# EAGLE design BP_devboard (EAGLE 9.7.0)
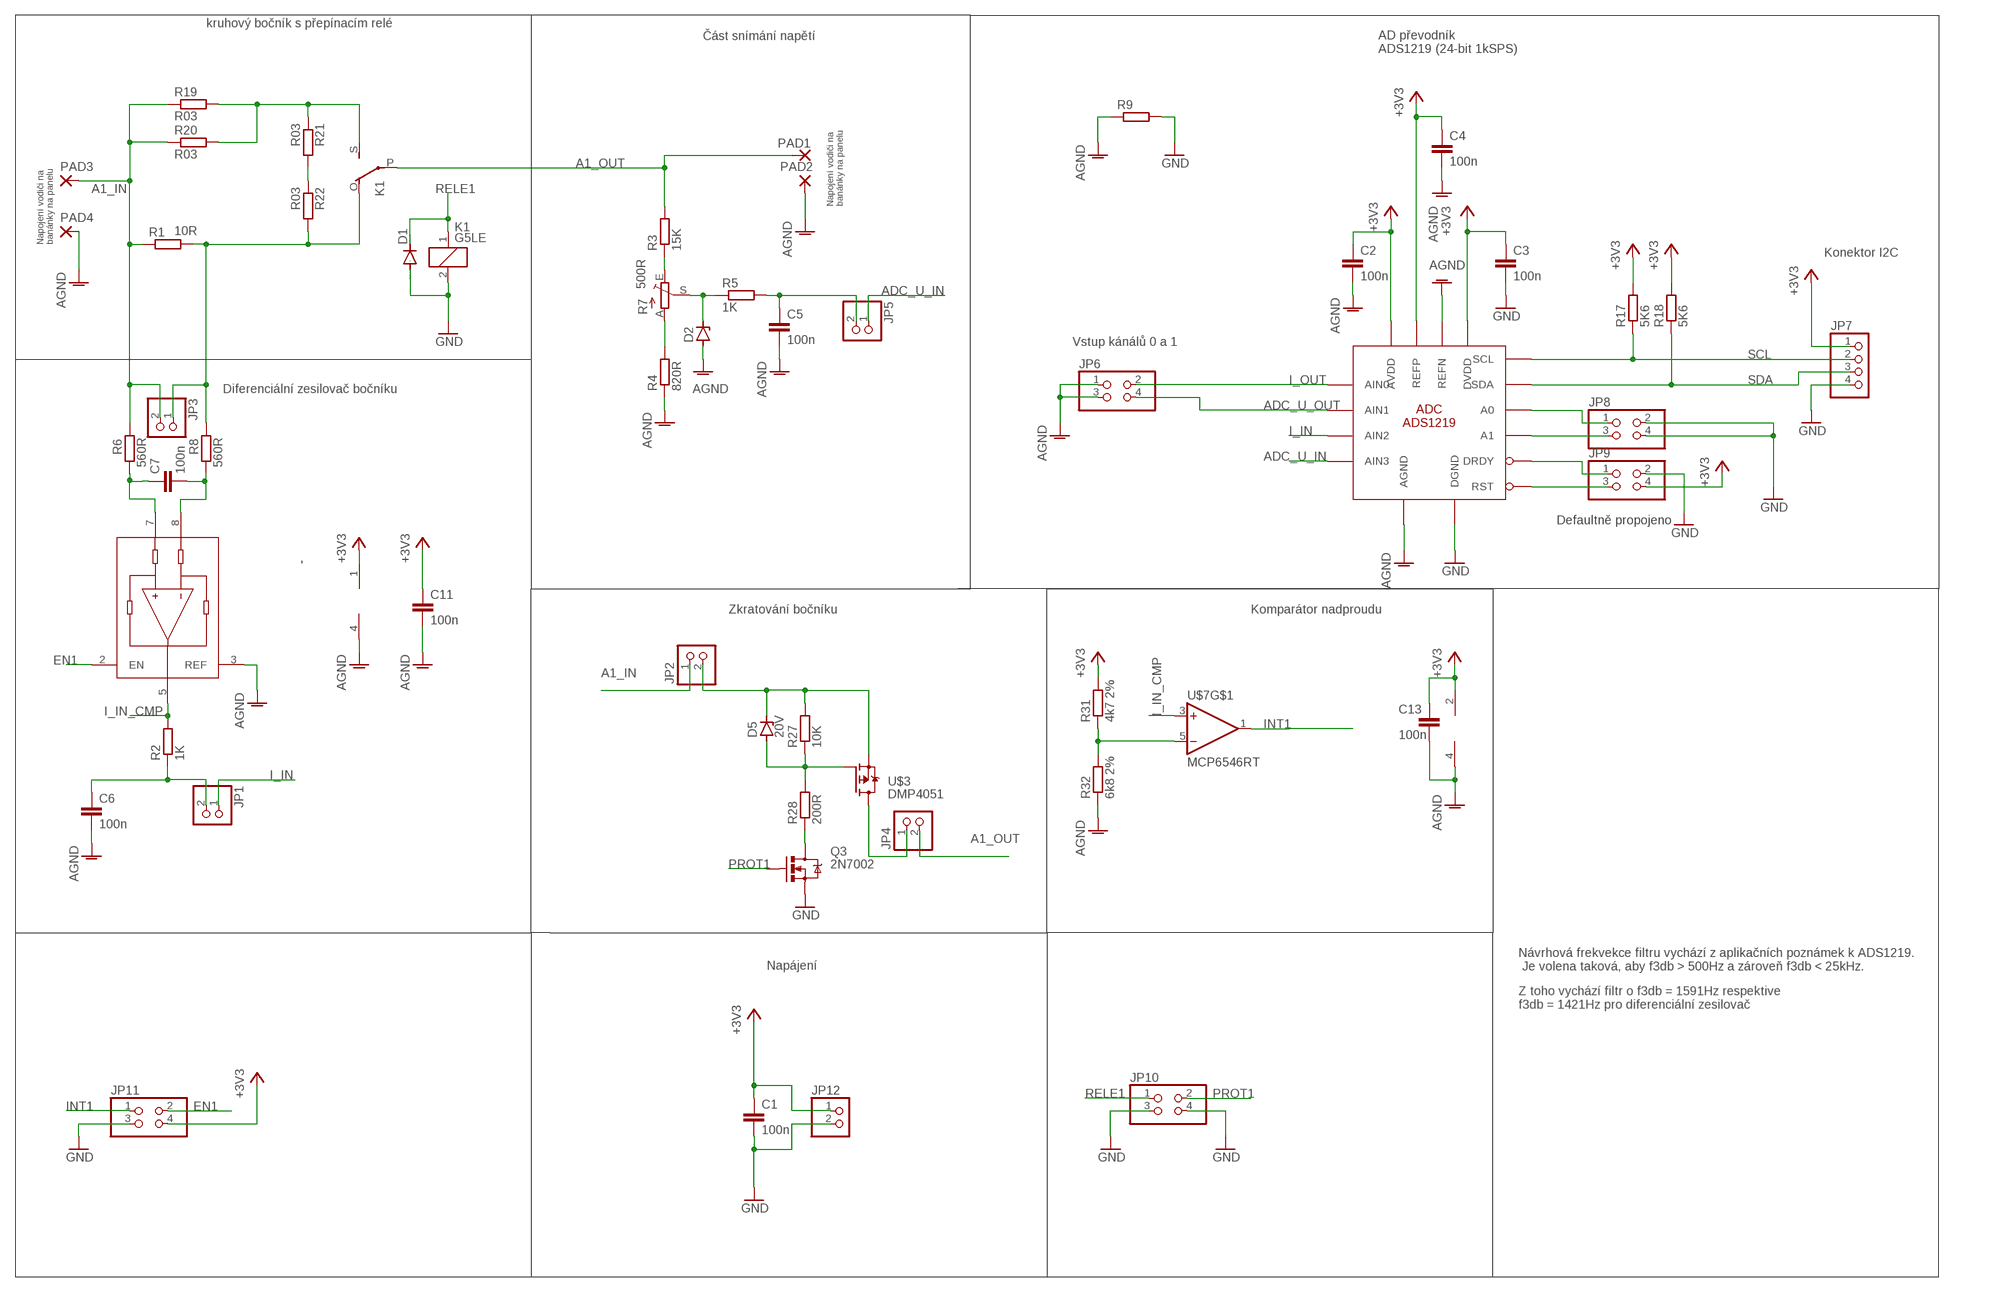
[diagram p0: schematic, sheet 1]

## Parts
C1  100n  C-EUC0805  [C0805]
C2  100n  C-EUC0805  [C0805]
C3  100n  C-EUC0805  [C0805]
C4  100n  C-EUC0805  [C0805]
C5  100n  C-EUC0805  [C0805]
C6  100n  C-EUC0805  [C0805]
C7  100n  C-EUC0805  [C0805]
C11  100n  C-EUC0805  [C0805]
C13  100n  C-EUC0805  [C0805]
D1  DIODE-MELF-MLL41  [MELF-MLL41]
D2  ZENER-DIODESOD80C  [SOD80C]
D5  20V  ZENER-DIODESMB  [SMB]
JP1  PINHD-1X2  [1X02]
JP2  PINHD-1X2  [1X02]
JP3  PINHD-1X2  [1X02]
JP4  PINHD-1X2  [1X02]
JP5  PINHD-1X2  [1X02]
JP6  PINHD-2X2  [2X02]
JP7  PINHD-1X4  [1X04]
JP8  PINHD-2X2  [2X02]
JP9  PINHD-2X2  [2X02]
JP10  PINHD-2X2  [2X02]
JP11  PINHD-2X2  [2X02]
JP12  PINHD-1X2  [1X02]
K1  G5LE  [G5LE]
PAD1  2,15/1,0  [2,15/1,0]
PAD2  2,15/1,0  [2,15/1,0]
PAD3  2,15/1,0  [2,15/1,0]
PAD4  2,15/1,0  [2,15/1,0]
Q3  2N7002  MOSFET-NCHANNEL2N7002PW  [SOT323]
R1  10R  R-EU_R1206  [R1206]
R2  1K  R-EU_R0805  [R0805]
R3  15K  R-EU_R0805  [R0805]
R4  820R  R-EU_R0805  [R0805]
R5  1K  R-EU_R0805  [R0805]
R6  560R  R-EU_R0805  [R0805]
R7  500R  TRIM_EU-PT10  [PT-10]
R8  560R  R-EU_R0805  [R0805]
R9  R-EU_R0805  [R0805]
R17  5K6  R-EU_R0805  [R0805]
R18  5K6  R-EU_R0805  [R0805]
R19  R03  R-EU_R1206  [R1206]
R20  R03  R-EU_R1206  [R1206]
R21  R03  R-EU_R1206  [R1206]
R22  R03  R-EU_R1206  [R1206]
R27  10K  R-EU_R0805  [R0805]
R28  200R  R-EU_R0805  [R0805]
R31  4k7 2%  R-EU_R0805  [R0805]
R32  6k8 2%  R-EU_R0805  [R0805]
U$2  ADS1219  [TSSOP16]
U$3  DMP4051  [TO252]
U$4  INA190  [SOT-23-THIN]
U$7  MCP6546RT  [SOT23-5]

## Nets
+3V3: C1.1 C2.1 C3.1 C4.1 C11.1 C13.1 JP7.1 JP9.4 JP11.4 JP12.1 R17.2 R18.2 R31.2 U$2.9(REFP) U$2.12(AVDD) U$2.13(DVDD) U$4.1(V+) U$7.2(V+)
A1: JP8.3 U$2.2(A1)
A1_IN: JP2.1 JP3.2 PAD3.1(P) R1.1 R6.2 R19.1 R20.1
A1_OUT: JP4.2 K1.P(2:P) PAD1.1(P) R3.2
ADC_U_IN: JP5.1 U$2.6(AIN3)
ADC_U_OUT: JP6.4 U$2.10(AIN1)
AGND: C2.2 C4.2 C5.2 C6.2 C11.2 C13.2 D2.A JP6.1 JP6.3 PAD2.1(P) PAD4.1(P) R4.1 R9.1 R32.1 U$2.5(AGND) U$2.8(REFN) U$4.3(REF) U$4.4(V-) U$7.4(V-)
EN1: JP11.2 U$4.2(EN)
GND: C1.2 C3.2 D1.A JP7.4 JP8.2 JP8.4 JP9.2 JP10.3 JP10.4 JP11.3 JP12.2 K1.2 Q3.2(S) R9.2 U$2.4(DGND)
I_IN: JP1.1 U$2.7(AIN2)
I_IN_CMP: R2.2 U$4.5 U$7.3(+IN)
I_OUT: JP6.2 U$2.11(AIN0)
INT1: JP11.1 U$7.1(OUT)
N$1: JP3.1 K1.O(2:O) R1.2 R8.2 R22.2
N$2: R3.1 R7.E
N$3: R4.2 R7.A
N$4: C6.1 JP1.2 R2.1
N$5: D2.C R5.1 R7.S
N$6: JP4.1 U$3.3(D)
N$7: C7.2 R8.1 U$4.8(-)
N$8: D5.C JP2.2 R27.2 U$3.2(S)
N$9: D5.A R27.1 R28.2 U$3.1(G)
N$10: C5.1 JP5.2 R5.2
N$11: Q3.3(D) R28.1
N$13: JP8.1 U$2.1(A0)
N$14: JP9.1 U$2.14(DRDY)
N$15: JP9.3 U$2.3(RST)
N$16: K1.S(2:S) R19.2 R20.2 R21.1
N$17: R31.1 R32.2 U$7.5(-IN)
N$18: C7.1 R6.1 U$4.7(+)
N$19: R21.2 R22.1
PROT1: JP10.2 Q3.1(G)
RELE1: D1.C JP10.1 K1.1
SCL: JP7.2 R17.1 U$2.16(SCL)
SDA: JP7.3 R18.1 U$2.15(SDA)

## Notes on the sheet
- kruhový bočník s přepínacím relé
- Část snímání napětí
- AD převodník
  ADS1219 (24-bit 1kSPS)
- Napojení vodiči na
  banánky na panelu
- Napojení vodiči na
  banánky na panelu
- Konektor I2C
- Vstup kánálů 0 a 1
- Diferenciální zesilovač bočníku
- Defaultně propojeno
- Zkratování bočníku | Komparátor nadproudu
- Návrhová frekvekce filtru vychází z aplikačních poznámek k ADS1219.
   Je volena taková, aby f3db > 500Hz a zároveň f3db < 25kHz.
- Napájení
- Z toho vychází filtr o f3db = 1591Hz respektive 
  f3db = 1421Hz pro diferenciální zesilovač

## Library data of the parts
C1-C7 C11 C13 = rcl:C-EU: CAPACITOR, European symbol; SPICEPREFIX: C
D1 = diode:DIODE-: DIODE
D2 D5 = diode:ZENER-DIODE: Z-Diode
JP1-JP5 JP12 = pinhead:PINHD-1X2: PIN HEADER
JP6 JP8-JP11 = pinhead:PINHD-2X2: PIN HEADER
JP7 = pinhead:PINHD-1X4: PIN HEADER
K1 = relay:G5LE: RELAY 1 x switch, 10 A/120 V AC, 8 A/30 V DC, Omron; OC_FARNELL: unknown; OC_NEWARK: unknown
PAD1-PAD4 = wirepad:2,15/1,0: THROUGH-HOLE PAD
Q3 = BeagleBone_Blue_R3:MOSFET-NCHANNEL: Common NMOSFET Parts MFG P/N Store ID Prod ID FDD8780 TRANS-09984 SI7820DN TRANS-11055 FDS6630A IC-08089 2N7002PW TRANS-11151 FQP30N06L COM-10213 TRANS-10060 BSS123LT1G TRANS-08345 BSS138 TRANS-00830 BS170 2N7000; PROD_ID: TRANS-11151
R1-R6 R8 R9 R17-R22 R27 R28 R31 R32 = rcl:R-EU_: RESISTOR, European symbol; SPICEPREFIX: R
R7 = pot:TRIM_EU-: POTENTIOMETER
U$2 = ADC_TI:ADS1219
U$3 = Mosfety:DMP4051
U$4 = merici_zesilovace:INA190
U$7 = merici_zesilovace:MCP6546RT

## Board
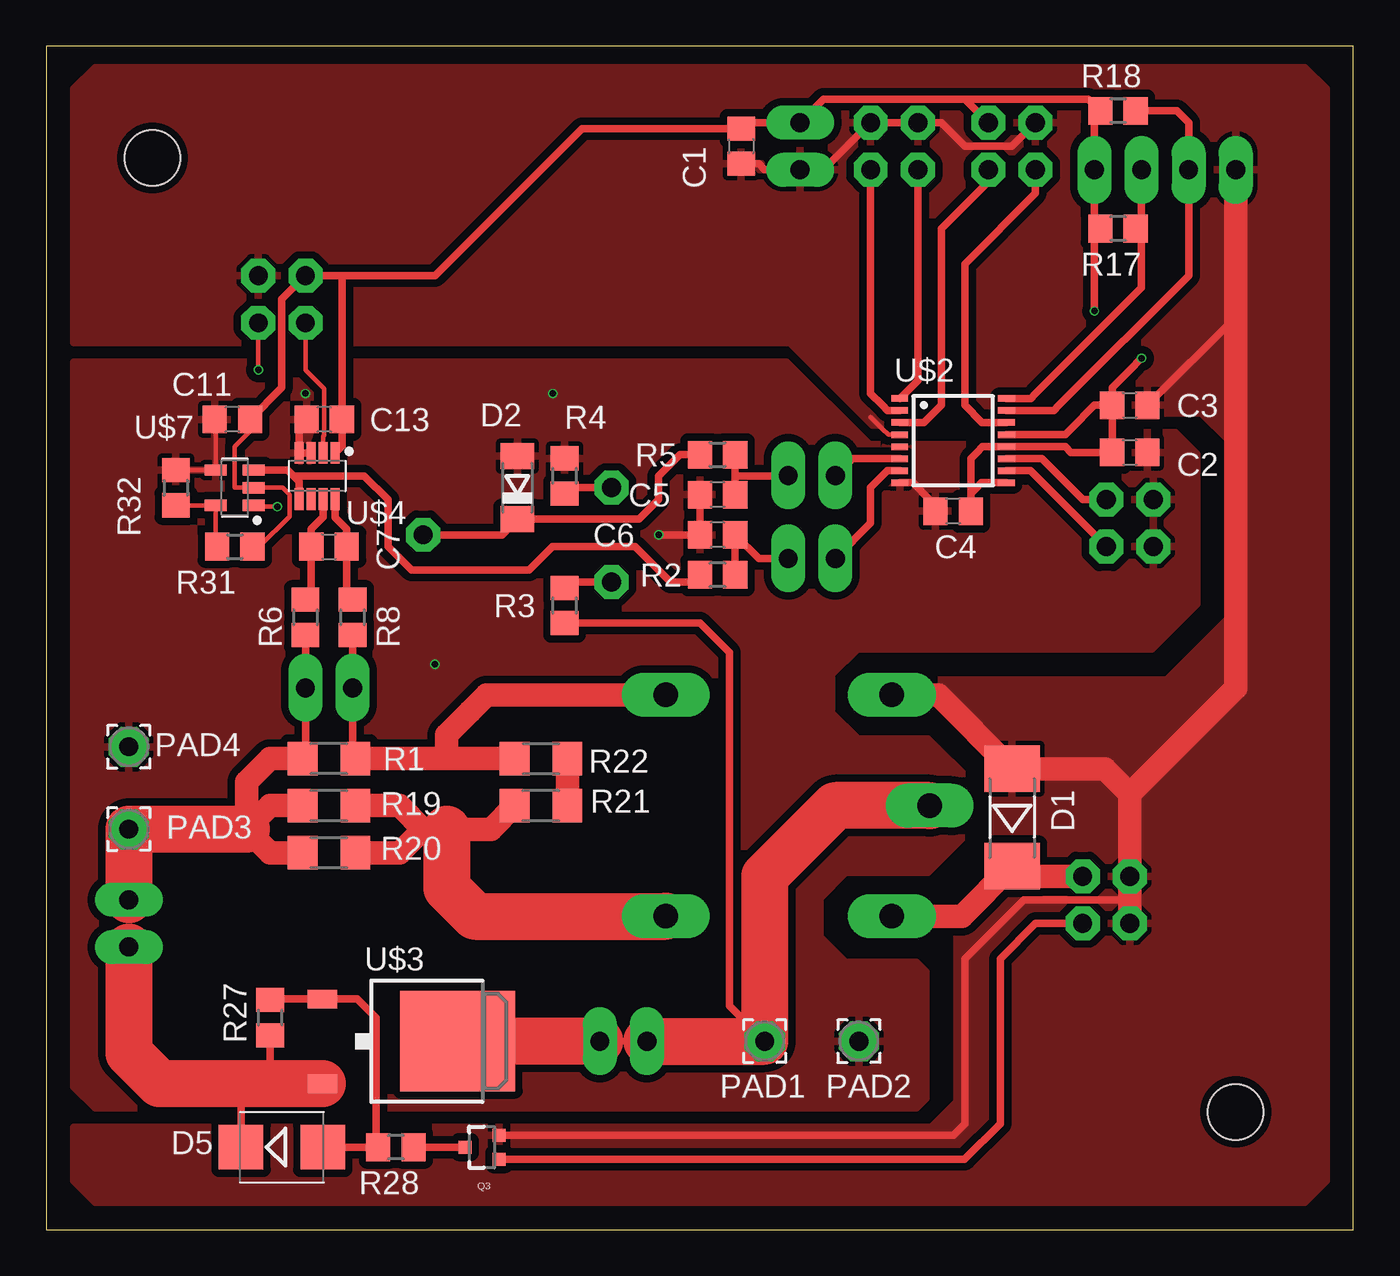
[diagram p1: board, top side]
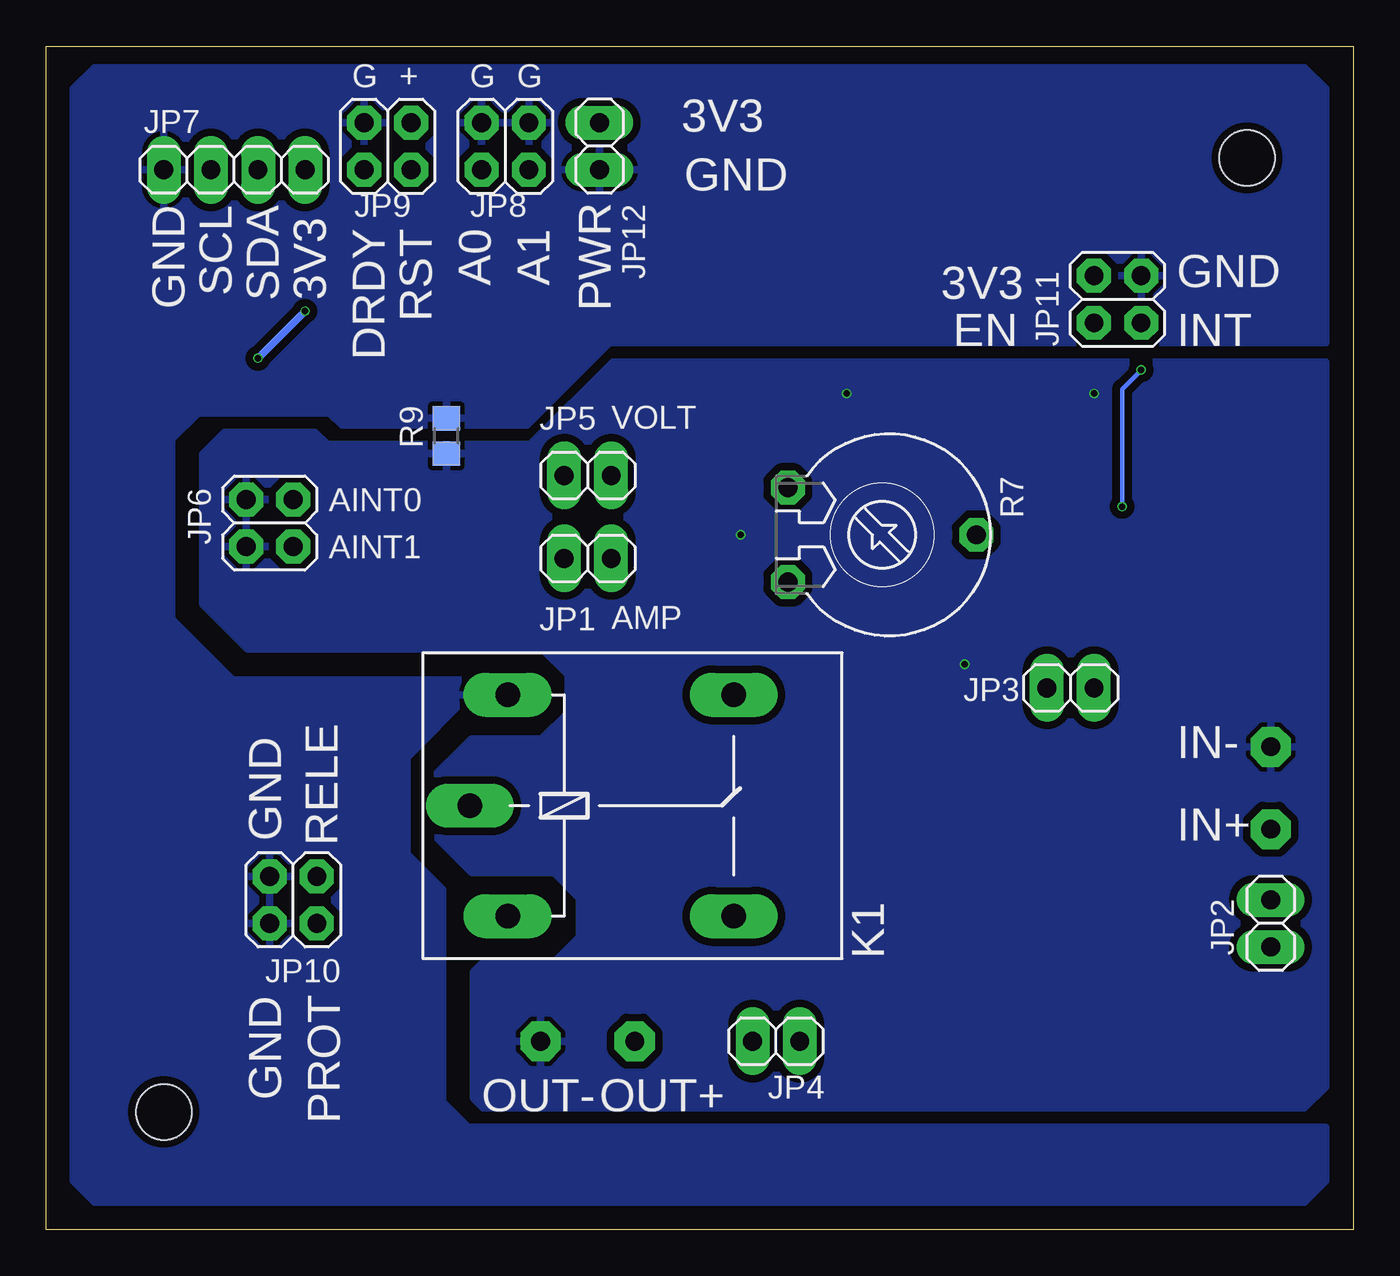
[diagram p2: board, bottom side, seen from below]

Size 70.47 x 63.8 mm. Coordinates in mm from the lower left corner, seen from the top.
Outline: 0,0 70.47,0 70.47,63.8 0,63.8 0,0
Copper layers (1*16): Top 0.035mm / dielectric 1.6mm / Bottom 0.035mm
Design rules "jlcpcb-2layers.dru": minimum track width 5mil, minimum drill 0.3mm, track to track 5mil, track to pad 5mil, pad to pad 5mil, via to via 5mil, smd to smd 5mil, copper to edge 0.2mm, drill to drill 6mil, minimum pad ring 10mil, minimum via ring 3mil, stop-mask expansion 4mil, vias tented up to drill 0mil, thermal gap 10mil
Holes 3 mm at 64.13,6.35 5.71,57.78

### Footprints (pad centres in the part's own frame; a part is rotated, then mirrored left to right if it is on the bottom)
C0805 = smd 1.3 x 1.5: 1 -0.95,0; 2 0.95,0
MELF-MLL41 = smd 2.5 x 3: A 2.625,0; C -2.625,0
SOD80C = smd 1.4 x 1.8: A 1.7,0; C -1.7,0
SMB = smd 2.4 x 2.4: A 2.2,0; C -2.2,0
1X02 = drill 1.016 long: 1 -1.27,0; 2 1.27,0
2X02 = drill 1.016 octagon: 1 -1.27,-1.27; 2 -1.27,1.27; 3 1.27,-1.27; 4 1.27,1.27
1X04 = drill 1.016 long: 1 -3.81,0; 2 -1.27,0; 3 1.27,0; 4 3.81,0
G5LE = drill 1.321 long: 1 -7.493,-5.969; 2 -7.493,5.969; O 4.699,5.969; P -9.525,0; S 4.699,-5.969
2,15/1,0 = drill 1.016 pad 2.159 octagon: 1 0,0
SOT323 = smd 0.7 x 0.7: 1 -0.65,-0.925; 2 0.65,-0.925; 3 0,0.925
R1206 = smd 1.6 x 1.803: 1 -1.422,0; 2 1.422,0
R0805 = smd 1.3 x 1.5: 1 -0.95,0; 2 0.95,0
PT-10 = drill 1.016 octagon: A -2.54,-5.08; E 2.54,-5.08; S 0,5.08
TSSOP16 = smd 0.9 x 0.35: 1 -2.875,2.275; 2 -2.875,1.625; 3 -2.875,0.975; 4 -2.875,0.325; 5 -2.875,-0.325; 6 -2.875,-0.975; 7 -2.875,-1.625; 8 -2.875,-2.275; 9 2.875,-2.275; 10 2.875,-1.625; 11 2.875,-0.975; 12 2.875,-0.325; 13 2.875,0.325; 14 2.875,0.975; 15 2.875,1.625; 16 2.875,2.275
TO252 = smd 1 x 1.6: 1 -2.28,-4.8; 2 2.28,-4.8 | smd 5.4 x 6.2: 3 0,2.5
SOT-23-THIN = smd 1.18 x 0.478: 1 -1.246,0.975; 2 -1.246,0.325; 3 -1.246,-0.325; 4 -1.246,-0.975; 5 1.246,-0.975; 6 1.246,-0.325; 7 1.246,0.325; 8 1.246,0.975
SOT23-5 = smd 1.182 x 0.612: 1 -1.025,0.95; 2 -1.025,0; 3 -1.025,-0.95; 4 1.025,-0.95; 5 1.025,0.95

### Placement (x,y rotation side)
C1  37.47,58.42 270 top
C2  58.42,41.91 0 top
C3  58.42,44.45 0 top
C4  48.89,38.73 180 top
C5  36.2,39.62 180 top
C6  36.2,37.46 180 top
C7  15.24,36.83 0 top
C11  10.03,43.69 180 top
C13  14.99,43.69 180 top
D1  52.07,22.23 90 top
D2  25.4,40 90 top
D5  12.7,4.45 0 top
JP1  41.28,36.2 0 bottom
JP2  4.45,16.51 270 bottom
JP3  15.24,29.21 0 bottom
JP4  31.11,10.16 180 bottom
JP5  41.28,40.67 0 bottom
JP6  58.42,38.1 270 bottom
JP7  60.33,57.15 180 bottom
JP8  45.72,58.42 0 bottom
JP9  52.07,58.42 0 bottom
JP10  57.15,17.78 180 bottom
JP11  12.7,50.16 90 bottom
JP12  40.64,58.42 270 bottom
K1  38.1,22.86 0 bottom
PAD1  38.73,10.16 0 top
PAD2  43.81,10.16 0 top
PAD3  4.45,21.59 0 top
PAD4  4.45,26.04 0 top
Q3  23.5,4.45 90 top
R1  15.24,25.4 0 top
R2  36.2,35.31 180 top
R3  27.94,33.66 270 top
R4  27.94,40.64 270 top
R5  36.2,41.78 0 top
R6  13.97,33.02 270 top
R7  25.4,37.46 270 bottom
R8  16.51,33.02 270 top
R9  48.89,42.8 90 bottom
R17  57.78,53.97 180 top
R18  57.78,60.33 180 top
R19  15.24,22.86 0 top
R20  15.24,20.32 0 top
R21  26.67,22.86 0 top
R22  26.67,25.4 180 top
R27  12.07,11.43 270 top
R28  18.85,4.45 180 top
R31  10.16,36.83 0 top
R32  6.98,40 270 top
U$2  48.89,42.54 0 top
U$3  19.68,10.16 270 top
U$4  14.61,40.64 270 top
U$7  10.16,40 180 top

### Tracks (layer width: path | path; a pad name or v marks a point on that pad's centre or on a via)
+3V3  (via drill 0.35)
  Top 0.254: C11.1 10.98,43.05 10.16,42.23 10.16,41.91 10.16,40 U$7.2 12.75,40 13.11,39.64 13.11,38.46 11.48,36.83 R31.2
  Top 0.406: R17.2 56.67,54.13 | 56.67,54.13 56.52,54.29 JP7.1 56.52,60 R18.2 56.2,60.96 49.53,60.96 | U$2.9 50.43,40.27 50.17,40 49.84,39.68 C4.1 49.84,41.59 50.17,41.91 50.47,42.22 U$2.12 54.94,42.22 55.24,41.91 C2.1 C3.1 | C3.1 56.52,44.45 55.24,43.18 54.94,42.87 U$2.13 | JP9.4 49.53,60.96 | 49.53,60.96 46.99,60.96 41.91,60.96 JP12.1 37.78,59.69 C1.1 28.89,59.37 24.13,54.61 20.96,51.43 15.88,51.43 | C3.1 57.47,45.41 58.42,46.35 v59.05,46.99 | v56.52,49.53 56.52,53.97 56.67,54.13 | U$4.1 15.94,42.24 C13.1 15.94,50.1 15.94,51.37 15.88,51.43 | C11.1 12.7,45.41 12.7,49.53 12.7,50.16 JP11.4 15.88,51.43
  Bottom 0.406: v59.05,46.99 v56.52,49.53
A1
  Top 0.406: JP8.3 44.45,45.09 45.08,44.45 45.36,44.17 U$2.2
A1_IN
  Top 0.406: 13.97,25.55 R1.1 13.97,25.55 | R6.2 JP3.2 13.97,25.55
  Top 1.27: R19.1 12.7,22.86 12.07,22.86 10.8,21.59 | 10.8,21.59 12.07,20.32 R20.1 | R1.1 12.07,25.4 10.8,24.13 10.8,21.59
  Top 2.54: 10.8,21.59 6.98,21.59 PAD3.1 JP2.1
A1_OUT
  Top 0.406: R3.2 35.24,32.7 35.56,32.38 36.83,31.11 36.83,13.33 36.83,12.06 PAD1.1
  Top 2.54: K1.P 42.55,22.86 38.73,19.05 PAD1.1 JP4.2
ADC_U_IN
  Top 0.406: U$2.6 43.47,41.57 42.57,40.66 JP5.1
ADC_U_OUT
  Top 0.406: U$2.10 53.06,40.92 53.97,40 JP6.4
AGND  (via drill 0.35)
  Top 0.254: C11.2 9.14,43.64 U$7.4 R32.1
  Top 0.406: U$2.8 46.72,40.27 47.62,39.37 47.95,39.05 C4.2 | C5.2 C6.2 v33.02,37.46 | C13.2 13.63,43.28 U$4.4 U$4.3
  other vias: 13.97,45.09 20.96,30.48 27.31,45.09
  pour Top (isolate 0.406): 55.36,42.37 55.29,42.34 44.41,42.34 44.33,42.37 39.92,46.79 1.47,46.79 1.47,7.7 2.62,6.55 46.91,6.55 47.42,7.07 47.42,13.89 46.91,14.4 43.14,14.4 43.06,14.43 41.74,15.76 41.71,15.83 41.71,17.82 41.74,17.9 43.06,19.22 43.14,19.25 47.54,19.25 49.96,21.67 49.96,24.05 47.54,26.47 43.77,26.47 43.7,26.5 42.37,27.82 42.34,27.9 42.34,29.89 42.37,29.96 43.7,31.29 43.77,31.32 59.61,31.32 62.03,33.74 62.03,41.83 60.88,42.98 55.96,42.98
  pour Bottom (isolate 0.406): 55.36,42.37 55.29,42.34 44.41,42.34 44.33,42.37 39.92,46.79 1.47,46.79 1.47,7.7 2.62,6.55 46.91,6.55 47.42,7.07 47.42,13.89 46.91,14.4 43.14,14.4 43.06,14.43 41.74,15.76 41.71,15.83 41.71,17.82 41.74,17.9 43.06,19.22 43.14,19.25 47.54,19.25 49.96,21.67 49.96,24.05 47.54,26.47 43.77,26.47 43.7,26.5 42.37,27.82 42.34,27.9 42.34,29.89 42.37,29.96 43.7,31.29 43.77,31.32 59.61,31.32 62.03,33.74 62.03,41.83 60.88,42.98 55.96,42.98
EN1
  Top 0.254: U$4.2 14.93,42.79 14.96,42.82 14.96,45.36 14.61,45.72 13.97,46.35 JP11.2
GND
  Top 0.254: U$2.4 45.39,42.87 45.08,43.18 44.45,43.81
  Top 0.406: JP9.2 52.07,58.42 49.53,58.42 48.89,59.05 48.26,59.69 JP8.2 JP8.4 41.91,57.15 JP12.2 38.73,57.15 38.42,57.47 C1.2 | JP7.4 64.13,49.21 C3.2 | Q3.2 48.91,5.09 49.53,5.71 49.53,14.6 52.7,17.78 58.42,17.78
  Top 1.27: K1.2 48.09,28.83 D1.A 57.06,24.85 58.42,23.5 | JP10.4 58.42,17.78 JP10.3 58.42,23.5 | 58.42,23.5 64.13,29.21 64.13,48.26 JP7.4
  pour Top (isolate 0.406): 49.07,6.87 47.74,5.54 47.67,5.51 1.47,5.51 1.47,2.62 2.62,1.47 67.86,1.47 69.01,2.62 69.01,61.51 67.86,62.66 2.62,62.66 1.47,61.51 1.47,47.83 40.05,47.83 40.12,47.8 44.53,43.38 54.53,43.38 55.13,43.99 55.2,44.02 62.27,44.02 62.35,43.99 63.67,42.66 63.7,42.59 63.7,32.98 63.67,32.9 60.44,29.67 60.37,29.64 44.65,29.64 44.65,28.78 47.67,28.78 47.74,28.75 50.97,25.52 51,25.44 51,20.28 50.97,20.2 49.1,18.33 49.1,6.94
  pour Bottom (isolate 0.406): 49.07,6.87 47.74,5.54 47.67,5.51 1.47,5.51 1.47,2.62 2.62,1.47 67.86,1.47 69.01,2.62 69.01,61.51 67.86,62.66 2.62,62.66 1.47,61.51 1.47,47.83 40.05,47.83 40.12,47.8 44.53,43.38 54.53,43.38 55.13,43.99 55.2,44.02 62.27,44.02 62.35,43.99 63.67,42.66 63.7,42.59 63.7,32.98 63.67,32.9 60.44,29.67 60.37,29.64 44.65,29.64 44.65,28.78 47.67,28.78 47.74,28.75 50.97,25.52 51,25.44 51,20.28 50.97,20.2 49.1,18.33 49.1,6.94
I_IN
  Top 0.406: JP1.1 44.45,38.1 44.45,40 45.36,40.92 U$2.7
I_IN_CMP
  Top 0.406: U$4.5 13.63,40 13.63,40.34 13.34,40.64 | 13.34,40.64 13.02,40.95 U$7.3 | 13.34,40.64 17.14,40.64 18.41,39.37 18.41,36.83 19.68,35.56 21.59,35.56 26.04,35.56 27.31,36.83 31.75,36.83 33.66,34.92 34.86,34.92 R2.2
I_OUT
  Top 0.406: U$2.11 53.68,41.57 55.88,39.37 JP6.2
INT1  (via drill 0.35)
  Top 0.254: U$7.1 11.25,38.99 v12.45,38.99 | JP11.1 v11.43,46.35
  Bottom 0.254: v12.45,38.99 12.45,45.33 v11.43,46.35
N$1
  Top 0.406: R1.2 16.51,25.55 JP3.1 R8.2
  Top 1.27: R22.2 21.59,25.4 | 21.59,25.4 R1.2 16.51,25.55 | 21.59,25.4 21.59,26.67 22.86,27.94 23.75,28.83 K1.O
N$2
  Top 0.406: R3.1 28.26,34.92 R7.E
N$3
  Top 0.406: R7.A 28.57,40 28.25,40 R4.2
N$4
  Top 0.406: R2.1 C6.1 38.42,36.2 JP1.2
N$5
  Top 0.406: R7.S 24.56,37.46 D2.C 31.96,38.3 32.39,38.73 33.02,39.37 33.02,40.64 34.16,41.78 R5.1
N$6
  Top 2.54: JP4.1 U$3.3
N$7
  Top 0.406: U$4.8 15.58,38.39 15.88,38.1 16.19,37.78 C7.2 16.19,34.29 R8.1
N$8
  Top 0.406: R27.2 12.07,7.88 | D5.C 10.5,7.58 10.8,7.88
  Top 2.54: U$3.2 12.07,7.88 10.8,7.88 6.09,7.88 5.71,8.25 4.45,9.53 4.45,11.43 JP2.2
N$9
  Top 0.406: R27.1 12.12,12.44 U$3.1 16.77,12.44 17.78,11.43 17.78,6.98 17.78,4.56 R28.2 D5.A
N$10
  Top 0.406: C5.1 37.14,40.64 | 37.14,40.64 R5.2 | JP5.2 39.98,40.64 37.14,40.64
N$11
  Top 0.406: Q3.3 R28.1
N$13
  Top 0.406: JP8.1 46.99,45.79 U$2.1
N$14
  Top 0.406: JP9.1 53.34,55.88 49.53,52.07 49.53,44.45 50.46,43.52 U$2.14
N$15
  Top 0.406: JP9.3 50.8,56.52 48.26,53.97 48.26,44.45 47.33,43.52 U$2.3
N$16
  Top 1.27: R20.2 18.41,20.32 19.05,20.32 20.32,21.59 | R19.2 18.41,22.86 19.05,22.86 20.32,21.59 | R21.1 23.98,21.59 22.86,21.59 21.59,21.59 20.32,21.59
  Top 2.54: 21.59,21.59 21.59,18.42 23.11,16.89 K1.S
N$17
  Top 0.254: R31.1 9.14,36.91 U$7.5 R32.2
N$18
  Top 0.406: U$4.7 14.93,38.42 14.61,38.1 14.29,37.78 C7.1 14.29,34.29 R6.1
N$19
  Top 1.27: R22.1 R21.2
PROT1
  Top 0.406: Q3.1 39.99,3.8 49.52,3.8 49.53,3.81 51.44,5.71 51.44,10.79 51.44,14.6 53.34,16.51 JP10.2
RELE1
  Top 1.27: K1.1 49.36,16.89 D1.C 52.62,19.05 JP10.1
SCL
  Top 0.406: U$2.16 53.08,44.82 53.34,45.09 59.05,50.8 59.05,53.97 | 59.05,53.97 JP7.2 | R17.1 59.05,53.97
SDA
  Top 0.406: U$2.15 54.33,44.17 54.61,44.45 61.59,51.43 JP7.3 61.59,59.69 60.96,60.33 R18.1

### Text on the board
bPlace: 3V3 | G | G | + | G | GND | SDA | SCL | GND | A1 | A0 | RST | DRDY | 3V3 | GND | 3V3 | PWR | INT | EN | VOLT | AINT0 | AINT1 | AMP | RELE | IN- | IN+ | GND | GND | OUT+ | OUT- | PROT